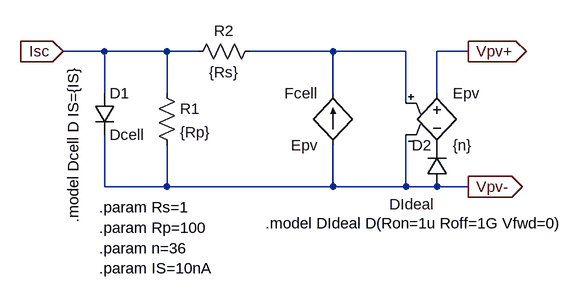
[diagram p0: schematic pvcell.asc]
pvcell.asc, the LTspice schematic file:
Version 4
SHEET 1 920 680
WIRE 128 -16 64 -16
WIRE 224 -16 128 -16
WIRE 272 -16 224 -16
WIRE 480 -16 352 -16
WIRE 592 -16 480 -16
WIRE 688 -16 640 -16
WIRE 128 48 128 -16
WIRE 224 48 224 -16
WIRE 480 48 480 -16
WIRE 640 48 640 -16
WIRE 592 64 592 -16
WIRE 128 192 128 112
WIRE 224 192 224 128
WIRE 224 192 128 192
WIRE 480 192 480 128
WIRE 480 192 224 192
WIRE 592 192 592 112
WIRE 592 192 480 192
WIRE 640 192 592 192
WIRE 688 192 640 192
FLAG 64 -16 Isc
IOPIN 64 -16 In
FLAG 688 -16 Vpv+
IOPIN 688 -16 Out
FLAG 688 192 Vpv-
IOPIN 688 192 Out
SYMBOL diode 112 48 R0
SYMATTR InstName D1
SYMATTR Value Dcell
SYMBOL res 208 32 R0
SYMATTR InstName R1
SYMATTR Value {Rp}
SYMBOL res 368 -32 R90
WINDOW 0 0 56 VBottom 2
WINDOW 3 32 56 VTop 2
SYMATTR InstName R2
SYMATTR Value {Rs}
SYMBOL e 640 32 R0
SYMATTR InstName Epv
SYMATTR Value {n}
SYMBOL f 480 128 R180
WINDOW 0 24 80 Left 2
WINDOW 3 24 0 Left 2
SYMATTR InstName Fcell
SYMATTR Value Epv
SYMATTR Value2 1
SYMBOL diode 656 192 R180
WINDOW 0 24 64 Left 2
WINDOW 3 20 -27 Left 2
SYMATTR InstName D2
SYMATTR Value DIdeal
TEXT 80 8 VRight 2 !.model Dcell D IS={IS}
TEXT 120 224 Left 2 !.param Rs=1\n.param Rp=100\n.param n=36\n.param IS=10nA
TEXT 376 248 Left 2 !.model DIdeal D(Ron=1u Roff=1G Vfwd=0)

The netlist it stands for:
* pvcell.asc
D1 Isc Vpv- Dcell
R1 Isc Vpv- {Rp}
R2 N001 Isc {Rs}
Epv Vpv+ P001 N001 Vpv- {n}
Fcell Vpv- N001 Epv 1
D2 Vpv- P001 DIdeal
.model D D
.lib standard.dio
.model Dcell D IS={IS}
.param Rs=1
.param Rp=100
.param n=36
.param IS=10nA
.model DIdeal D(Ron=1u Roff=1G Vfwd=0)
.backanno
.end